# Altium schematic sheet SCH_Freematics_ONE.SchDoc
size C; SheetNumber: 1; SheetTotal: 1
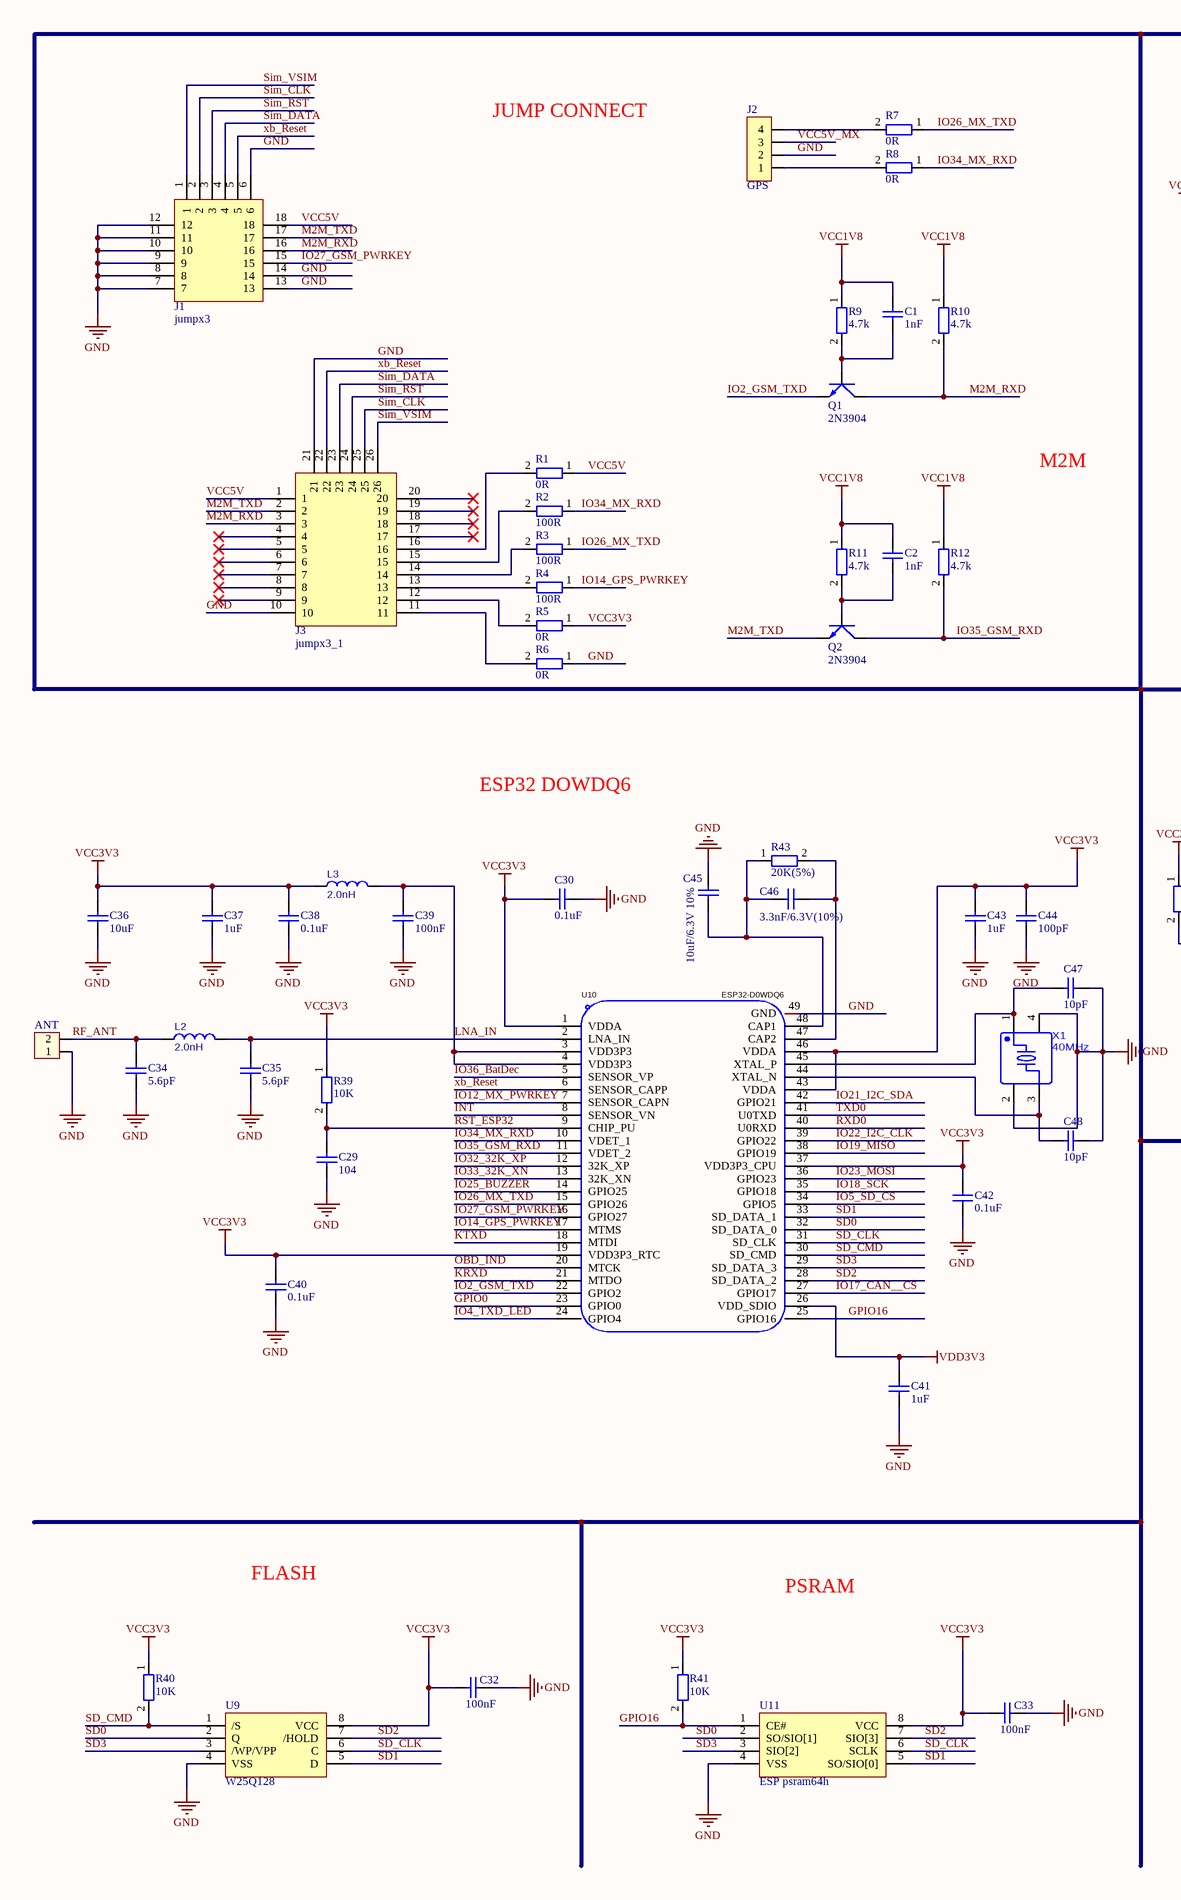
[diagram p0: SCH_Freematics_ONE.SchDoc, left]
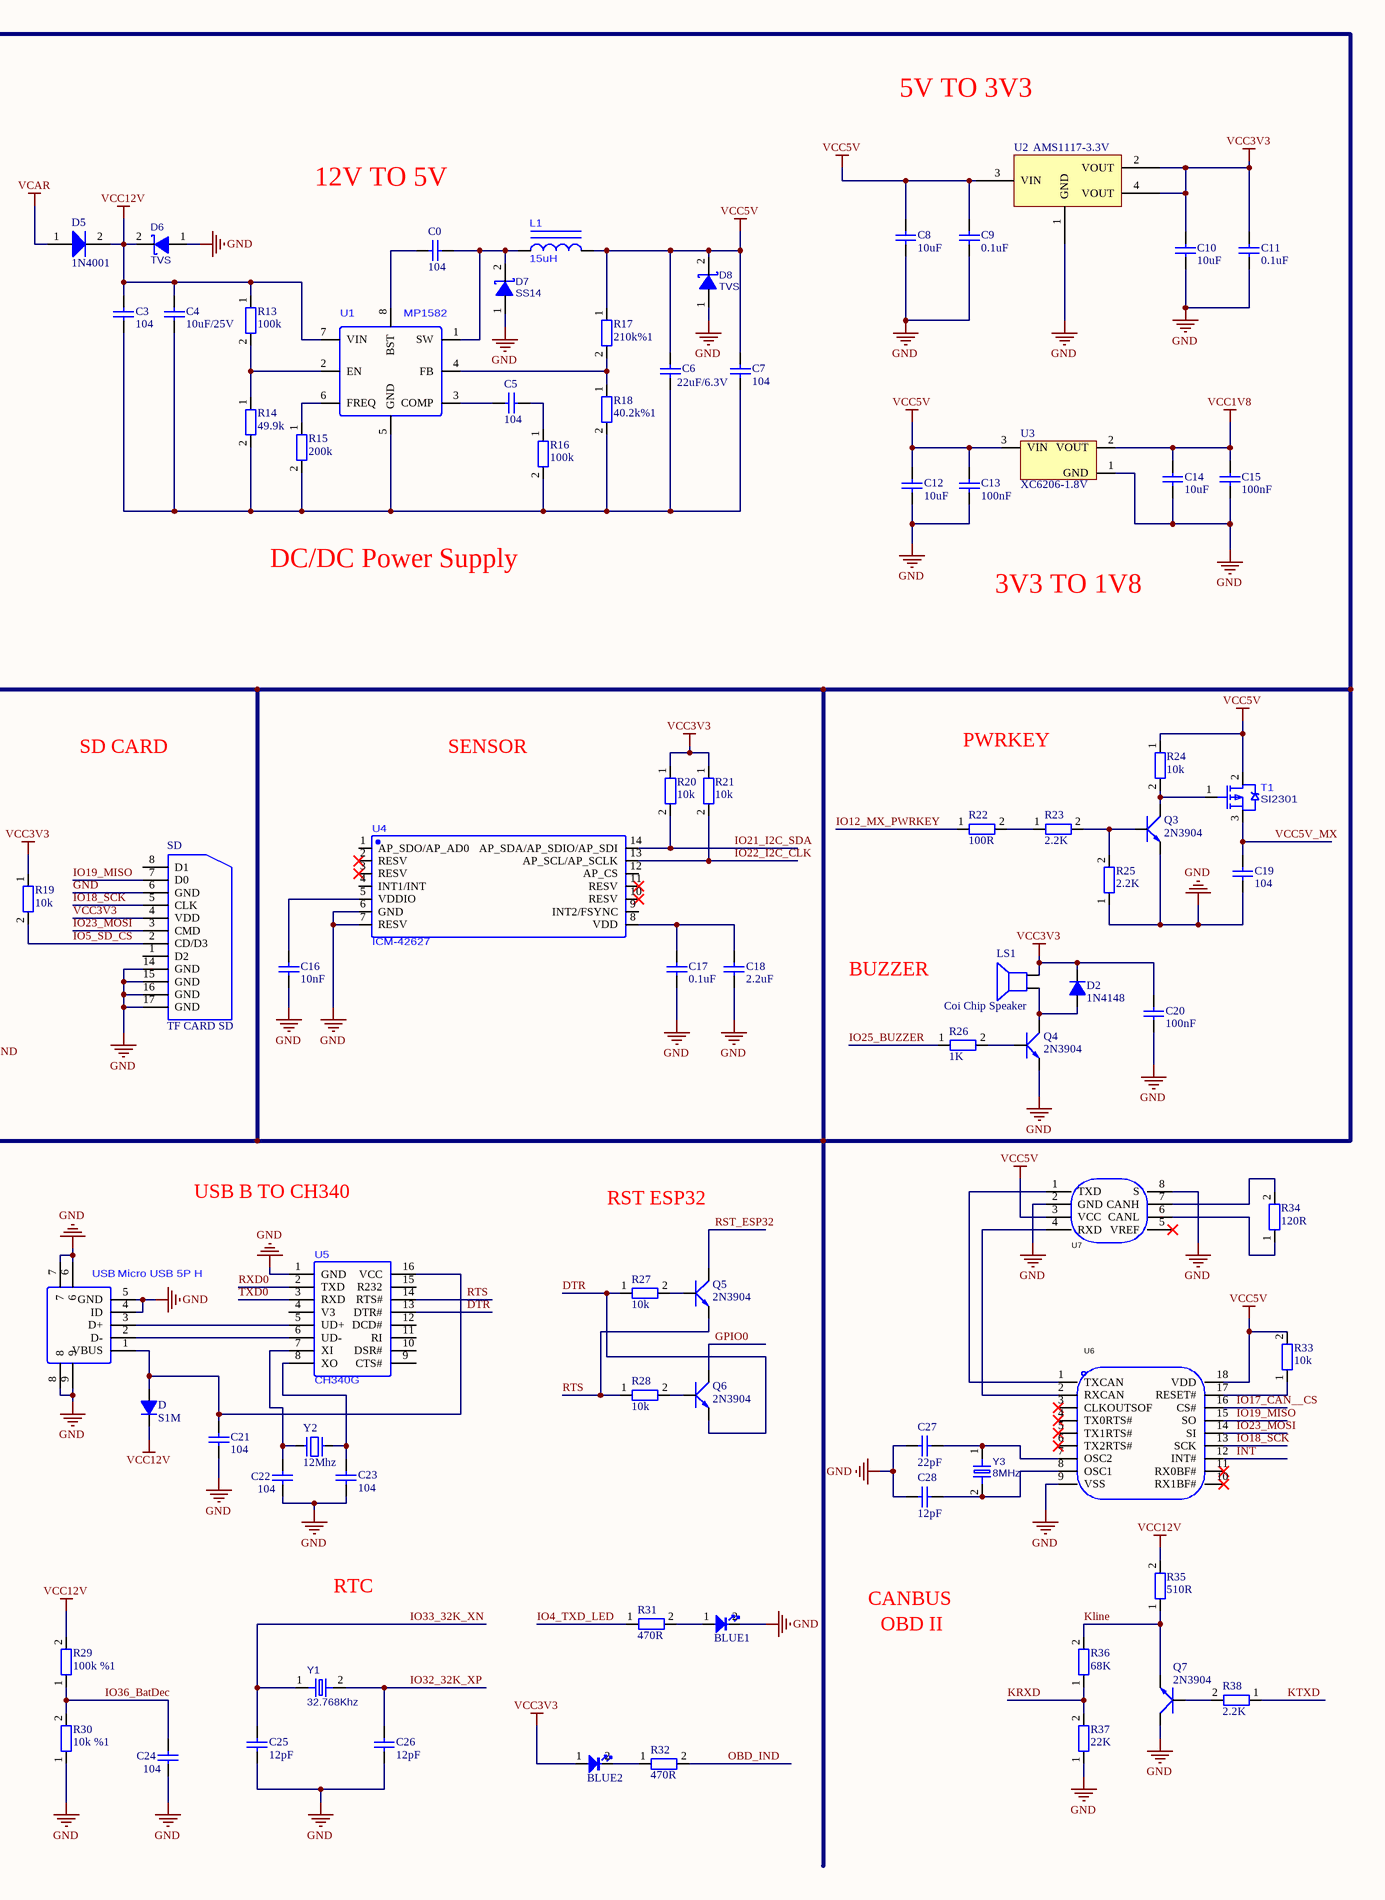
[diagram p1: SCH_Freematics_ONE.SchDoc, right]

## Parts
ANT  Header 2  [HED2T]  (value not drawn)
BLUE1  LED  [LED 0603]  (value not drawn)
BLUE2  LED  [LED 0603]  (value not drawn)
C0  104  [CAP0201]
C1  1nF  [CAP0201]
C2  1nF  [CAP0201]
C3  104  [CAP0201]
C4  10uF/25V  [CAP0201]
C5  104  [CAP0201]
C6  22uF/6.3V  [CAP0201]
C7  104  [CAP0201]
C8  10uF  [CAP0201]
C9  0.1uF  [CAP0201]
C10  10uF  [CAP0201]
C11  0.1uF  [CAP0201]
C12  10uF  [CAP0201]
C13  100nF  [CAP0201]
C14  10uF  [CAP0201]
C15  100nF  [CAP0201]
C16  10nF  [CAP0201]
C17  0.1uF  [CAP0201]
C18  2.2uF  [CAP0201]
C19  104  [CAP0201]
C20  100nF  [CAP0201]
C21  104  [CAP0201]
C22  104  [CAP0201]
C23  104  [CAP0201]
C24  104  [CAP0201]
C25  12pF  [CAP0201]
C26  12pF  [CAP0201]
C27  22pF  [CAP0201]
C28  12pF  [CAP0201]
C29  104  [CAP0201]
C30  0.1uF  [CAP0201]
C32  100nF  [CAP0201]
C33  100nF  [CAP0201]
C34  5.6pF  [CAP0201]
C35  5.6pF  [CAP0201]
C36  10uF  [CAP0201]
C37  1uF  [CAP0201]
C38  0.1uF  [CAP0201]
C39  100nF  [CAP0201]
C40  0.1uF  [CAP0201]
C41  1uF  [CAP0201]
C42  0.1uF  [CAP0201]
C43  1uF  [CAP0201]
C44  100pF  [CAP0201]
C45  10uF/6.3V 10%  [CAP_0805]
C46  3.3nF/6.3V(10%)  [CAP0201]
C47  10pF  [CAP0201]
C48  10pF  [CAP0201]
D  S1M  [DIODE_M7_1N4007]
D2  1N4148  [DIODE_M7_1N4007]
D5  1N4001  [Diode HOLD STAND DO-41 TYPE 1A]
D6  TVS  [DO-214AC(SMA)]
D7  SS14  [DO-214AC(SMA)]
D8  TVS  [DO-214AC(SMA)]
J1  jumpx3
J2  GPS  [JP 1x4 DT]
J3  jumpx3_1
L1  15uH
L2  2.0nH  [INDUCTOR_0201]
L3  2.0nH  [INDUCTOR_0201]
LS1  Coi Chip Speaker  [Coi Chip Speacker]
Q1  2N3904  [SOT-23]
Q2  2N3904  [SOT-23]
Q3  2N3904  [SOT-23]
Q4  2N3904  [SOT-23]
Q5  2N3904  [SOT-23]
Q6  2N3904  [SOT-23]
Q7  2N3904  [SOT-23]
R1  0R  [RESC0201_L]
R2  100R  [RESC0201_L]
R3  100R  [RESC0201_L]
R4  100R  [RESC0201_L]
R5  0R  [RESC0201_L]
R6  0R  [RESC0201_L]
R7  0R  [RESC0201_L]
R8  0R  [RESC0201_L]
R9  4.7k  [RESC0201_L]
R10  4.7k  [RESC0201_L]
R11  4.7k  [RESC0201_L]
R12  4.7k  [RESC0201_L]
R13  100k  [RESC0201_L]
R14  49.9k  [RESC0201_L]
R15  200k  [RESC0201_L]
R16  100k  [RESC0201_L]
R17  210k%1  [RESC0201_L]
R18  40.2k%1  [RESC0201_L]
R19  10k  [RESC0201_L]
R20  10k  [RESC0201_L]
R21  10k  [RESC0201_L]
R22  100R  [RESC0201_L]
R23  2.2K  [RESC0201_L]
R24  10k  [RESC0201_L]
R25  2.2K  [RESC0201_L]
R26  1K  [RESC0201_L]
R27  10k  [RESC0201_L]
R28  10k  [RESC0201_L]
R29  100k %1  [RESC0201_L]
R30  10k %1  [RESC0201_L]
R31  470R  [RESC0201_L]
R32  470R  [RESC0201_L]
R33  10k  [RESC0201_L]
R34  120R  [RESC0201_L]
R35  510R  [RESC0201_L]
R36  68K  [RESC0201_L]
R37  22K  [RESC0201_L]
R38  2.2K  [RESC0201_L]
R39  10K  [RESC0201_L]
R40  10K  [RESC0201_L]
R41  10K  [RESC0201_L]
R43  20K(5%)  [RESC0201_L]
SD  TF CARD SD  [SD TF-SD]
T1  SI2301  [TO-252-3]
U1  MP1582  [SOIC-8_L4.9-W3.9-P1.27-LS6.0-BL-EP]
U2  AMS1117-3.3V  [SOT-223]
U3  XC6206-1.8V  [SOT-23]
U4  ICM-42627  [LGA-14_L3.0-W2.5-P0.50-BL]
U5  CH340G  [CH340G]
U6  MCP2515  [SOIC-18_L11.6-W7.5-P1.27-LS10.3-BL]  (value not drawn)
U7  TJA1050T  [SOP-8]  (value not drawn)
U9  W25Q128  [SOIC-8]
U10  ESP32-D0WDQ6  [QFN-48_L6.0-W6.0-P0.40-BL-EP3.8]
U11  ESP psram64h  [SOP-8]
USB  Micro USB 5P H  [MICRO-USB_MICRO-USB-30]
X1  40MHz  [CRYSTAL 40MHZ WURTH]
Y1  32.768Khz  [CRYSTALS SMD FC-135 TYPE 2P]
Y2  12Mhz  [CRYSTALS SMD FC-135 TYPE 2P]
Y3  8MHz  [CRYSTALS SMD FC-135 TYPE 2P]

## Nets
GND: ANT.1 BLUE1.2 C8.2 C9.2 C10.2 C11.2 C12.2 C13.2 C14.2 C15.2 C16.2 C17.2 C18.2 C19.2 C20.1 C21.1 C22.1 C23.1 C24.1 C25.1 C26.1 C27.1 C28.1 C29.1 C30.1 C32.1 C33.1 C34.1 C35.1 C36.1 C37.1 C38.1 C39.1 C40.1 C41.1 C42.1 C43.1 C44.1 C45.1 C47.1 C48.1 D6.1(A) D7.1(A) D8.1(A) J1.6 J1.7 J1.8 J1.9 J1.10 J1.11 J1.12 J1.13 J1.14 J2.2 J3.10 J3.21 Q3.2(E) Q4.2(E) Q7.3(C) R6.1 R25.1 R30.1 R37.1 SD.6(GND) SD.14(GND) SD.15(GND) SD.16(GND) SD.17(GND) U2.1(GND) U3.1(GND) U4.6(GND) U4.7(RESV) U5.1(GND) U6.9(VSS) U7.2(GND) U7.8(S) U9.4(VSS) U10.49(GND) U11.4(VSS) USB.4(ID) USB.5(GND) USB.6 USB.7 USB.8 USB.9 X1.2(GND) X1.4(GND)
VCAR: D5.1(A)
VCC1V8: C1.2 C2.2 C14.1 C15.1 R9.1 R10.1 R11.1 R12.1 U3.2(VOUT)
VCC3V3: BLUE2.1 C10.1 C11.1 C20.2 C30.2 C32.2 C33.2 C36.2 C37.2 C38.2 C40.2 C42.2 C43.2 C44.2 D2.2(K) L3.1 LS1.2 R5.1 R19.1 R20.1 R21.1 R39.1 R40.1 R41.1 SD.4(VDD) U2.2(VOUT) U2.4(VOUT) U9.8(VCC) U10.1(VDDA) U10.19(VDD3P3_RTC) U10.37(VDD3P3_CPU) U10.43(VDDA) U10.46(VDDA) U11.8(VCC)
VCC5V: C6.1 C7.1 C8.1 C9.1 C12.1 C13.1 D8.2(K) J1.18 J3.1 L1.2 R1.1 R17.1 R24.1 R33.2 T1.2(D) U2.3(VIN) U3.3(VIN) U6.18(VDD) U7.3(VCC)
VCC12V: C3.2 C4.2 D.2(K) D5.2(K) D6.2(K) R13.1 R29.2 R35.2 U1.7(VIN)
VDD3V3: C41.2 U10.26(VDD_SDIO)
DTR: Q6.2(E) R27.1 U5.13(DTR#)
GPIO0: Q6.3(C) U10.23(GPIO0)
GPIO16: R41.2 U10.25(GPIO16) U11.1(CE#)
INT: U6.12(INT#) U10.8(SENSOR_VN)
IO2_GSM_TXD: Q1.2(E) U10.22(GPIO2)
IO4_TXD_LED: R31.1 U10.24(GPIO4)
IO5_SD_CS: R19.2 SD.2(CD/D3) U10.34(GPIO5)
IO12_MX_PWRKEY: R22.1 U10.7(SENSOR_CAPN)
IO14_GPS_PWRKEY: R4.1 U10.17(MTMS)
IO17_CAN__CS: U6.16(CS#) U10.27(GPIO17)
IO18_SCK: SD.5(CLK) U6.13(SCK) U10.35(GPIO18)
IO19_MISO: SD.7(D0) U6.15(SO) U10.38(GPIO19)
IO21_I2C_SDA: R20.2 U4.14(AP_SDA/AP_SDIO/AP_SDI) U10.42(GPIO21)
IO22_I2C_CLK: R21.2 U4.13(AP_SCL/AP_SCLK) U10.39(GPIO22)
IO23_MOSI: SD.3(CMD) U6.14(SI) U10.36(GPIO23)
IO25_BUZZER: R26.1 U10.14(GPIO25)
IO26_MX_TXD: R3.1 R7.1 U10.15(GPIO26)
IO27_GSM_PWRKEY: J1.15 U10.16(GPIO27)
IO32_32K_XP: C26.2 U10.12(32K_XP) Y1.2
IO33_32K_XN: C25.2 U10.13(32K_XN) Y1.1
IO34_MX_RXD: R2.1 R8.1 U10.10(VDET_1)
IO35_GSM_RXD: Q2.3(C) R12.2 U10.11(VDET_2)
IO36_BatDec: C24.2 R29.1 R30.2 U10.5(SENSOR_VP)
Kline: Q7.2(E) R35.1 R36.2
KRXD: R36.1 R37.2 U10.21(MTDO)
KTXD: R38.1 U10.18(MTDI)
LNA_IN: C35.2 C39.2 L2.2 L3.2 U10.2(LNA_IN) U10.3(VDD3P3) U10.4(VDD3P3)
M2M_RXD: J1.16 J3.3 Q1.3(C) R10.2
M2M_TXD: J1.17 J3.2 Q2.2(E)
OBD_IND: R32.2 U10.20(MTCK)
RF_ANT: ANT.2 C34.2 L2.1
RST_ESP32: C29.2 Q5.3(C) R39.2 U10.9(CHIP_PU)
RTS: Q5.2(E) R28.1 U5.14(RTS#)
RXD0: U5.2(TXD) U10.40(U0RXD)
SD0: U9.2(Q) U10.32(SD_DATA_0) U11.2(SO/SIO[1])
SD1: U9.5(D) U10.33(SD_DATA_1) U11.5(SO/SIO[0])
SD2: U9.7(/HOLD) U10.28(SD_DATA_2) U11.7(SIO[3])
SD3: U9.3(/WP/VPP) U10.29(SD_DATA_3) U11.3(SIO[2])
SD_CLK: U9.6(C) U10.31(SD_CLK) U11.6(SCLK)
SD_CMD: R40.2 U9.1(/S) U10.30(SD_CMD)
Sim_CLK: J1.2 J3.25
Sim_DATA: J1.4 J3.23
Sim_RST: J1.3 J3.24
Sim_VSIM: J1.1 J3.26
TXD0: U5.3(RXD) U10.41(U0TXD)
VCC5V_MX: C19.1 J2.3 T1.3(S)
xb_Reset: J1.5 J3.22 U10.6(SENSOR_CAPP)
NetBLUE1_1: BLUE1.1 R31.2
NetBLUE2_2: BLUE2.2 R32.1
NetC0_1: C0.1 D7.2(K) L1.1 U1.1(SW)
NetC0_2: C0.2 U1.8(BST)
NetC1_1: C1.1 Q1.1(B) R9.2
NetC2_1: C2.1 Q2.1(B) R11.2
NetC3_1: C3.1 C4.1 C6.2 C7.2 R14.2 R15.2 R16.2 R18.2 U1.5(GND)
NetC5_1: C5.1 U1.3(COMP)
NetC5_2: C5.2 R16.1
NetC16_1: C16.1 U4.5(VDDIO)
NetC17_1: C17.1 C18.1 U4.8(VDD)
NetC21_2: C21.2 D.1(A) U5.16(VCC) USB.1(VBUS)
NetC22_2: C22.2 U5.7(XI) Y2.1
NetC23_2: C23.2 U5.8(XO) Y2.2
NetC27_2: C27.2 U6.7(OSC2) Y3.1
NetC28_2: C28.2 U6.8(OSC1) Y3.2
NetC45_2: C45.2 C46.2 R43.1 U10.48(CAP1)
NetC46_1: C46.1 R43.2 U10.47(CAP2)
NetC47_2: C47.2 U10.45(XTAL_P) X1.1
NetC48_2: C48.2 U10.44(XTAL_N) X1.3
NetD2_1: D2.1(A) LS1.1 Q4.3(C)
NetJ2_1: J2.1 R8.2
NetJ2_4: J2.4 R7.2
NetJ3_11: J3.11 R6.2
NetJ3_12: J3.12 R5.2
NetJ3_13: J3.13 R4.2
NetJ3_14: J3.14 R3.2
NetJ3_15: J3.15 R2.2
NetJ3_16: J3.16 R1.2
NetQ3_1: Q3.1(B) R23.2 R25.2
NetQ3_3: Q3.3(C) R24.2 T1.1(G)
NetQ4_1: Q4.1(B) R26.2
NetQ5_1: Q5.1(B) R27.2
NetQ6_1: Q6.1(B) R28.2
NetQ7_1: Q7.1(B) R38.2
NetR13_2: R13.2 R14.1 U1.2(EN)
NetR15_1: R15.1 U1.6(FREQ)
NetR17_2: R17.2 R18.1 U1.4(FB)
NetR22_2: R22.2 R23.1
NetR33_1: R33.1 U6.17(RESET#)
NetR34_1: R34.1 U7.6(CANL)
NetR34_2: R34.2 U7.7(CANH)
NetU5_5: U5.5(UD+) USB.3(D+)
NetU5_6: U5.6(UD-) USB.2(D-)
NetU6_1: U6.1(TXCAN) U7.1(TXD)
NetU6_2: U6.2(RXCAN) U7.4(RXD)

Not connected (* = marked no-connect by the designer): J3 4* 5* 6* 7* 8* 9* 17* 18* 19* 20*; SD 1(D2) 8(D1); U4 1(AP_SDO/AP_AD0) 2(RESV)* 3(RESV)* 4(INT1/INT) 9(INT2/FSYNC) 10(RESV)* 11(RESV)* 12(AP_CS); U5 4(V3) 9(CTS#) 10(DSR#) 11(RI) 12(DCD#) 15(R232); U6 3(CLKOUTSOF)* 4(TX0RTS#)* 5(TX1RTS#)* 6(TX2RTS#)* 10(RX1BF#)* 11(RX0BF#)*; U7 5(VREF)*

## Notes on the sheet
- JUMP CONNECT
- 5V TO 3V3
- 12V TO 5V
- M2M
- DC/DC Power Supply
- 3V3 TO 1V8
- SD CARD
- SENSOR
- PWRKEY
- ESP32 DOWDQ6
- BUZZER
- USB B TO CH340
- RST ESP32
- FLASH
- PSRAM
- RTC
- CANBUS
- OBD II

## Library data of the parts
ANT = Hed2: Header 2 (Green); Value: Header 2
BLUE1 BLUE2 = LED SMD 0603: Emerald 0603 Light Emitting Diodes (LED) ROHS; Supplier 1: RSComponents
C0-C7 C12 C14 C16-C19 C21-C30 C34-C38 C40-C48 = CAP104-100nF-50V: Capacitor; 104: 100nF
C8-C11 = CAP 0805 50V 10%: 0805 Multilayer Ceramic Capacitors MLCC - SMD/SMT ROHS
C13 C15 C20 C32 C33 C39 = CAP104-100nF-50V: Capacitor; 104: 100nF
D = 1N5819W: Diode 1A; Value: 1N4007
D2 = D1A: Diode 1A; Value: 1N4007
D5 = DIODE SMD 1N4007: 1A 1kV Diodes - General Purpose ROHS; Chung_Loai: Dán; Don_Vi: Con; Ten_Linh_Kien: Diode M7 1N4007 SMD 1A 1000V; Ma_Hang: MH000944; Ghi_Chu: *; Supplier 1: RSComponents
D6-D8 = DIODE SMD SS54: 500uA@40V 40V 550mV@5A 5A SMA(DO-214AC) Schottky Barrier Diodes (SBD) ROHS; BOM_Manufacturer: JH; BOM_Manufacturer Part: SS34; Contributor: LCSC; BOM_Supplier: LCSC; BOM_Supplier Part: C478723; BOM_JLCPCB Part Class: Extended Part; spicePre: D; spiceSymbolName: SS34_C478723; Supplier 1: Farnell
J2 = JP 1x4 2.54 Duc Thang: Cắm; Ten_Linh_Kien: Jump Đơn Đực 2.54MM 1x40P Thẳng 11MM; Don_Vi: Con; Ma_Hang: MH000903; Ghi_Chu: *; Kieu_Chan: *; Chung_Loai: Cắm
L1 = Inductor
L2 L3 = INDUCTORS SMD: BOM_Manufacturer: Yanchuang(研创); BOM_Manufacturer Part: SCHF160808H47NJT; nameAlias: Inductance; Contributor: LCSC; BOM_Supplier: LCSC; BOM_Supplier Part: C578001; BOM_JLCPCB Part Class: Extended Part; spicePre: L; spiceSymbolName: SCHF160808H47NJT
LS1 = Coi Chip Speaker: Còi chip
Q1-Q7 = Trans BC817: SOT-23 - C8658; Value: C9014
R1-R41 R43 = RES 0603 1%_: ±1% - Chip Resistor - Surface Mount ROHS; Chung_Loai: Dán; Don_Vi: Con; So_Chan: 2; Ma_Hang: MH005880; Kieu_Chan: *
T1 = MOSFET: 100V 13A 66W 205mΩ P Channel MOSFETs ROHS; Supplier 1: RSComponents; Supplier 2: RSComponents
U2 = POWER CONVERTERS AMS117-3V3: 800mA 1.4V@(1A) Fixed 3.3V~3.3V Positive 1 18V SOT-223 Linear Voltage Regulators (LDO) ROHS; Value: AMS1117-3.3V SOT223; Don_Vi: Con; Ma_Hang: MH000596; Chung_Loai: Dán; Ghi_Chu: *; Kieu_Chan: *
U6 = MCP2515: Manufacturer: MICROCHIP(美国微芯); Symbol: MCP2515-I/SO; Add into BOM: yes; Data Rate: 1Mbps; Supply Current: 5mA; Supply Voltage(Vcc): 2.7V~5.5V; Device: MCP2515-I/SO; LCSC Part Name: 独立CAN控制器带SPI接口; Supplier Part: C12368; Manufacturer Part: MCP2515-I/SO; Supplier Footprint: SOIC-18-300mil; JLCPCB Part Class: Extended Part; Datasheet: https://atta.szlcsc.com/upload/public/pdf/source/20140724/1457707159251.pdf; Supplier: LCSC; Convert to PCB: yes; Type: CANController; Operating Temperature: -40℃~+85℃
U7 = TJA1050T: Manufacturer: NXP(恩智浦); Symbol: TJA1050T/CM,118; Add into BOM: yes; Supply Voltage: 4.75V~5.25V; Supply Current: 50mA; Device: TJA1050T/CM,118; LCSC Part Name: 4.75V~5.25V; Supplier Part: C6952; Manufacturer Part: TJA1050T/CM,118; Supplier Footprint: SOP-8; JLCPCB Part Class: Extended Part; Datasheet: https://www.nxp.com/docs/en/data-sheet/TJA1050.pdf; Supplier: LCSC; Convert to PCB: yes
U10 = ESP32-D0WDQ6: Manufacturer: ESPRESSIF(乐鑫); Add into BOM: yes; Frequency Range: 2412MHz~2484MHz; Interface: I2C；I2S；UART；SPI; Operating Voltage: 2.3V~3.6V; Output Power: 20.5dBm; Data Rate: 150Mbps; Current Of Transmitting: 240mA; Sensitivity: -98dBm; Receive Current: 95mA; Typical Application Frequency: 2.4GHz; Symbol: ESP32-D0WDQ6; Device: ESP32-D0WDQ6; LCSC Part Name: ESP32-D0WDQ6; Supplier Part: C129733; Manufacturer Part: ESP32-D0WDQ6; Supplier Footprint: QFN-48-EP(6x6); JLCPCB Part Class: Extended Part; Datasheet: https://atta.szlcsc.com/upload/public/pdf/source/20241030/ED17FC49A1F3B521B8AB27BB966A5465.pdf; Supplier: LCSC; Convert to PCB: yes; Applications: IoT；WiFi；Bluetooth; Operating Temperature: -40℃~+125℃
X1 = Crystal 40MHz
Y1 Y3 = CRYSTALS 2P: Crystals ROHS; BOM_Manufacturer: TAITIEN(泰艺电子); BOM_Manufacturer Part: XIHCELNANF-12MHZ; nameAlias: Frequency; Contributor: LCSC; BOM_Supplier: LCSC; BOM_Supplier Part: C295072; BOM_JLCPCB Part Class: Extended Part; spicePre: X; spiceSymbolName: XIHCELNANF-12MHZ
Y2 = Thach Anh 2 chan SMD: Crystal For all Crystal 2pin.; Value: 4Mhz